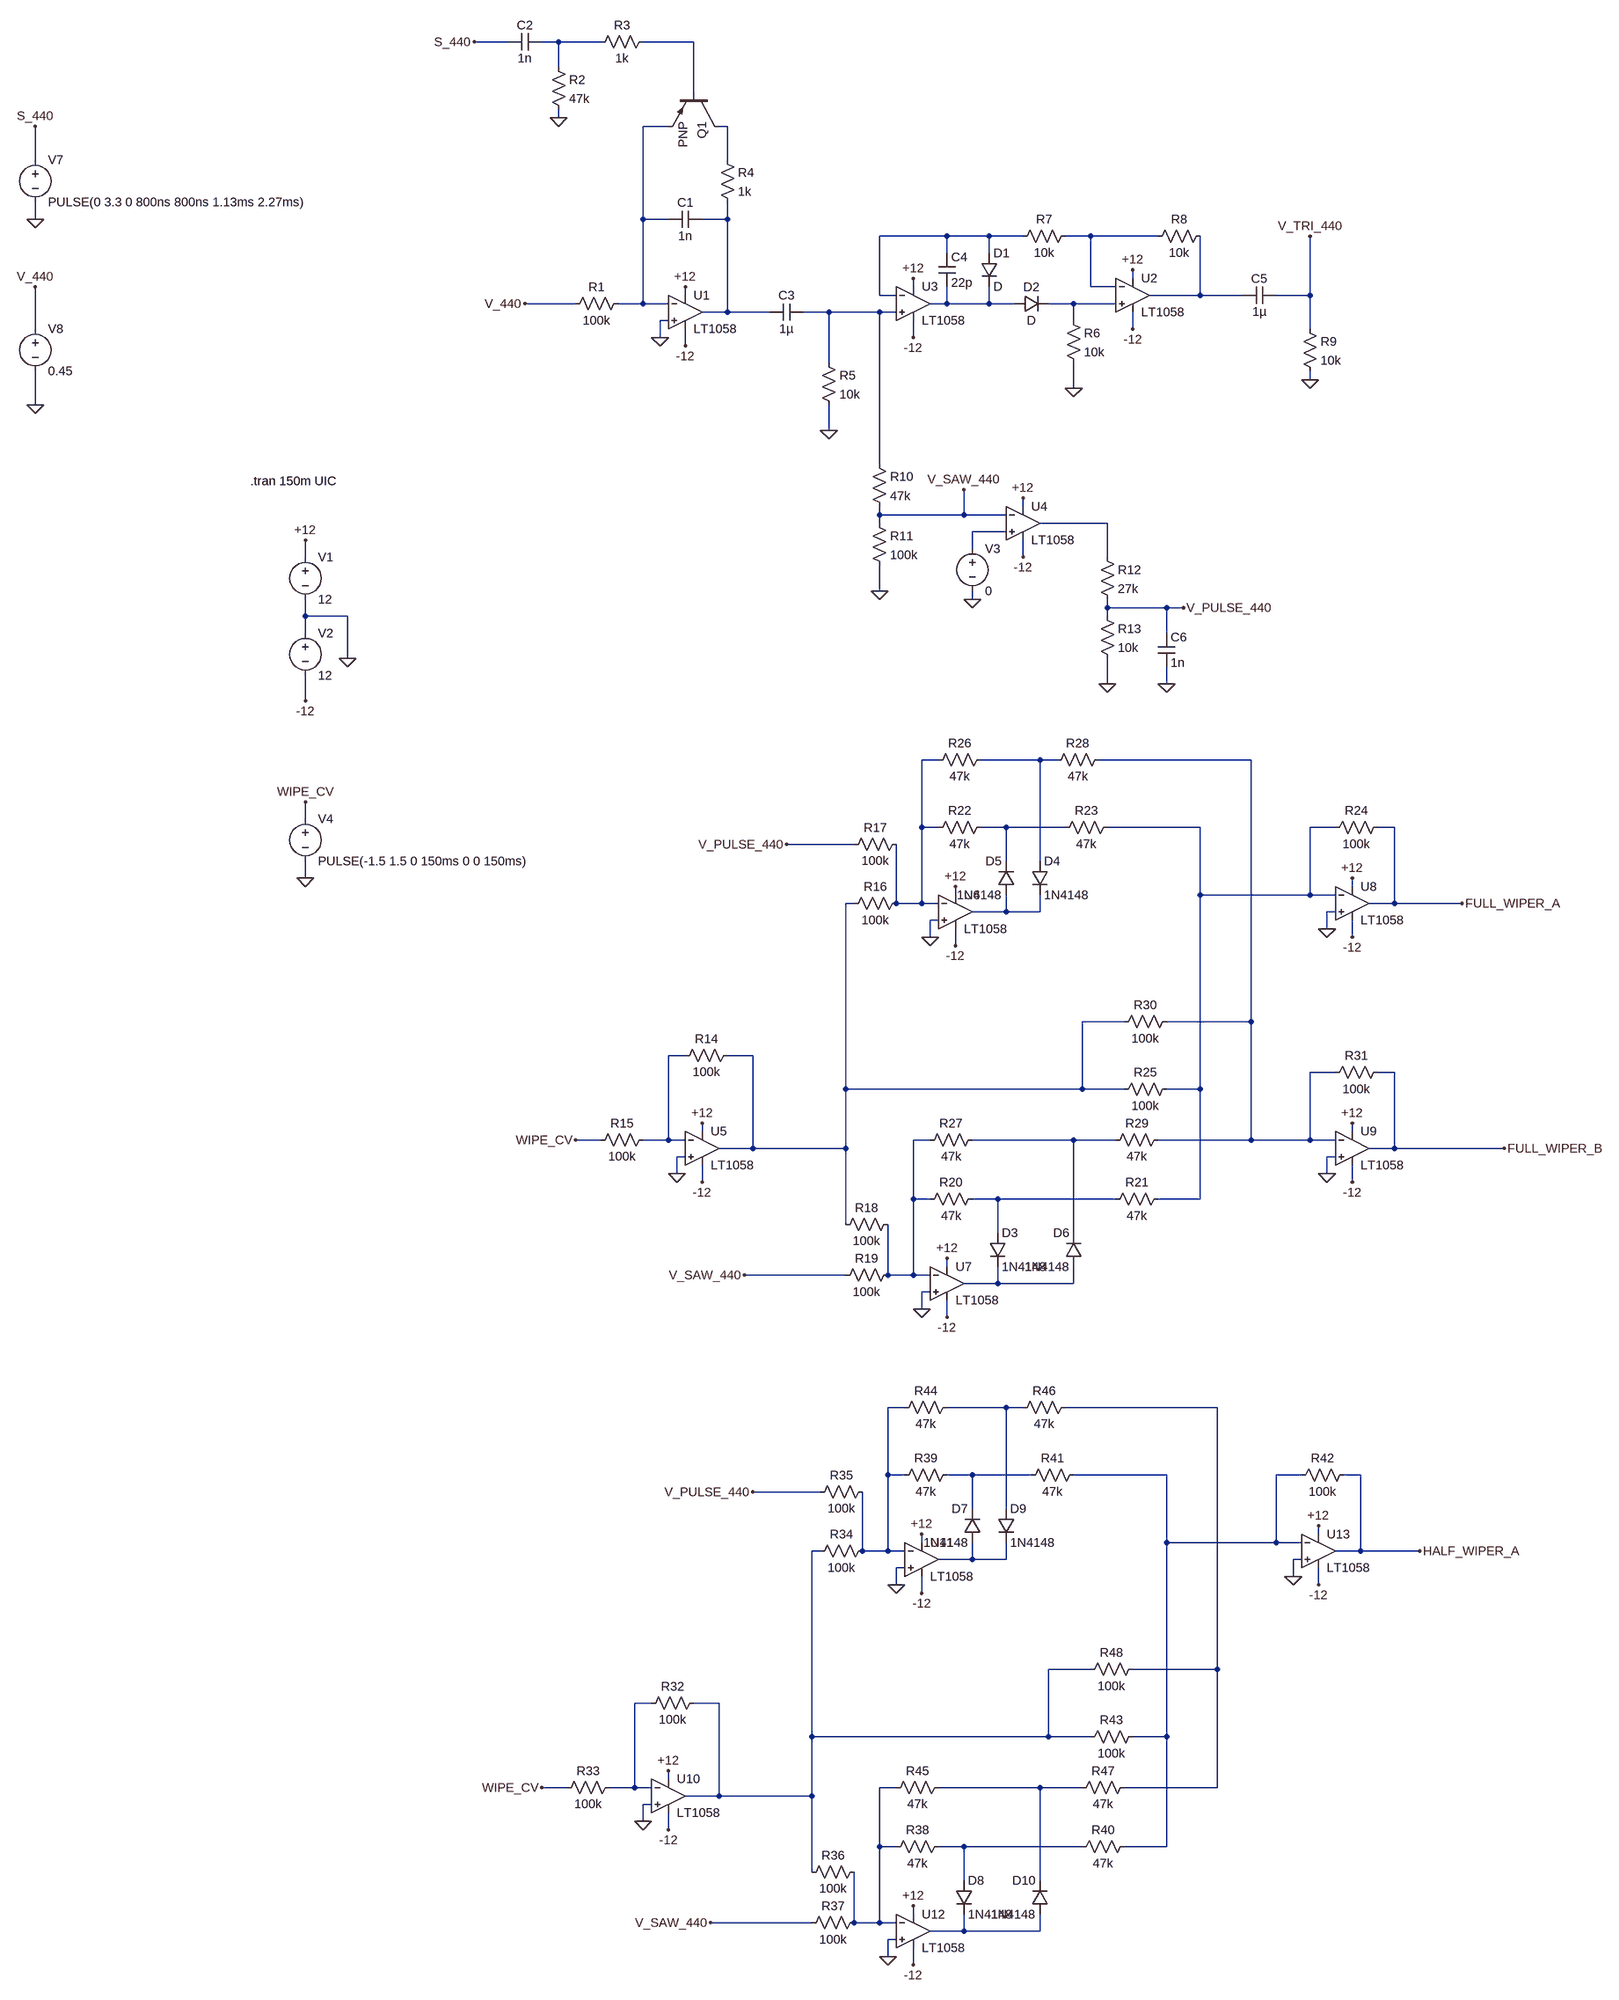
[diagram p0: schematic WiperSim.asc]
WiperSim.asc, the LTspice schematic file:
Version 4
SHEET 1 2512 3292
WIRE 448 -720 384 -720
WIRE 544 -720 512 -720
WIRE 624 -720 544 -720
WIRE 800 -720 704 -720
WIRE 544 -672 544 -720
WIRE 800 -624 800 -720
WIRE 544 -576 544 -592
WIRE 752 -560 704 -560
WIRE 864 -560 848 -560
WIRE -448 -496 -448 -560
WIRE 864 -496 864 -560
WIRE -448 -384 -448 -416
WIRE 704 -384 704 -560
WIRE 752 -384 704 -384
WIRE 864 -384 864 -416
WIRE 864 -384 816 -384
WIRE 1280 -352 1152 -352
WIRE 1360 -352 1280 -352
WIRE 1424 -352 1360 -352
WIRE 1552 -352 1504 -352
WIRE 1680 -352 1552 -352
WIRE 1280 -320 1280 -352
WIRE 1360 -320 1360 -352
WIRE 1632 -272 1632 -288
WIRE 1216 -256 1216 -272
WIRE 1552 -256 1552 -352
WIRE 1600 -256 1552 -256
WIRE 784 -240 784 -256
WIRE 1152 -240 1152 -352
WIRE 1184 -240 1152 -240
WIRE 1760 -240 1760 -352
WIRE 1760 -240 1664 -240
WIRE 1840 -240 1760 -240
WIRE 1968 -240 1968 -352
WIRE 1968 -240 1904 -240
WIRE 576 -224 480 -224
WIRE 704 -224 704 -384
WIRE 704 -224 656 -224
WIRE 752 -224 704 -224
WIRE 1280 -224 1280 -256
WIRE 1280 -224 1248 -224
WIRE 1360 -224 1360 -256
WIRE 1360 -224 1280 -224
WIRE 1408 -224 1360 -224
WIRE 1520 -224 1472 -224
WIRE 1600 -224 1520 -224
WIRE 864 -208 864 -384
WIRE 864 -208 816 -208
WIRE 944 -208 864 -208
WIRE 1056 -208 1008 -208
WIRE 1152 -208 1056 -208
WIRE 1184 -208 1152 -208
WIRE 752 -192 736 -192
WIRE 1520 -192 1520 -224
WIRE -448 -176 -448 -256
WIRE 1632 -176 1632 -208
WIRE 1968 -176 1968 -240
WIRE 736 -160 736 -192
WIRE 1216 -160 1216 -192
WIRE 784 -144 784 -176
WIRE 1056 -112 1056 -208
WIRE 1968 -80 1968 -96
WIRE 1520 -64 1520 -112
WIRE -448 -32 -448 -96
WIRE 1056 16 1056 -32
WIRE 1152 80 1152 -208
WIRE 1424 160 1424 144
WIRE 1152 176 1152 160
WIRE 1312 176 1312 128
WIRE 1312 176 1152 176
WIRE 1392 176 1312 176
WIRE 1152 192 1152 176
WIRE 1584 192 1456 192
WIRE 1392 208 1328 208
WIRE 1328 240 1328 208
WIRE 64 256 64 224
WIRE 1424 256 1424 224
WIRE 1584 256 1584 192
WIRE 1152 320 1152 272
WIRE 1328 336 1328 320
WIRE 1584 352 1584 336
WIRE 1696 352 1584 352
WIRE 1728 352 1696 352
WIRE 64 368 64 336
WIRE 144 368 64 368
WIRE 1584 368 1584 352
WIRE 64 400 64 368
WIRE 1696 400 1696 352
WIRE 144 448 144 368
WIRE 1584 496 1584 448
WIRE 1696 496 1696 464
WIRE 64 528 64 480
WIRE 1264 640 1232 640
WIRE 1456 640 1344 640
WIRE 1488 640 1456 640
WIRE 1856 640 1568 640
WIRE 64 752 64 720
WIRE 1232 768 1232 640
WIRE 1264 768 1232 768
WIRE 1392 768 1344 768
WIRE 1504 768 1392 768
WIRE 1760 768 1584 768
WIRE 2016 768 1968 768
WIRE 2128 768 2096 768
WIRE 1104 800 976 800
WIRE 1392 832 1392 768
WIRE 1456 832 1456 640
WIRE 64 864 64 832
WIRE 2048 880 2048 864
WIRE 1296 896 1296 880
WIRE 1760 896 1760 768
WIRE 1968 896 1968 768
WIRE 1968 896 1760 896
WIRE 2016 896 1968 896
WIRE 1104 912 1088 912
WIRE 1184 912 1184 800
WIRE 1232 912 1232 768
WIRE 1232 912 1184 912
WIRE 1264 912 1232 912
WIRE 2128 912 2128 768
WIRE 2128 912 2080 912
WIRE 2256 912 2128 912
WIRE 1392 928 1392 896
WIRE 1392 928 1328 928
WIRE 1456 928 1456 896
WIRE 1456 928 1392 928
WIRE 2016 928 2000 928
WIRE 1264 944 1248 944
WIRE 2000 960 2000 928
WIRE 1248 976 1248 944
WIRE 2048 976 2048 944
WIRE 1296 992 1296 960
WIRE 1616 1136 1536 1136
WIRE 1856 1136 1856 640
WIRE 1856 1136 1696 1136
WIRE 784 1200 752 1200
WIRE 912 1200 864 1200
WIRE 2016 1232 1968 1232
WIRE 2128 1232 2096 1232
WIRE 1088 1264 1088 912
WIRE 1536 1264 1536 1136
WIRE 1536 1264 1088 1264
WIRE 1616 1264 1536 1264
WIRE 1760 1264 1760 896
WIRE 1760 1264 1696 1264
WIRE 816 1344 816 1328
WIRE 2048 1344 2048 1328
WIRE 624 1360 576 1360
WIRE 752 1360 752 1200
WIRE 752 1360 704 1360
WIRE 784 1360 752 1360
WIRE 1248 1360 1216 1360
WIRE 1520 1360 1328 1360
WIRE 1600 1360 1520 1360
WIRE 1856 1360 1856 1136
WIRE 1856 1360 1680 1360
WIRE 1968 1360 1968 1232
WIRE 1968 1360 1856 1360
WIRE 2016 1360 1968 1360
WIRE 912 1376 912 1200
WIRE 912 1376 848 1376
WIRE 1088 1376 1088 1264
WIRE 1088 1376 912 1376
WIRE 2128 1376 2128 1232
WIRE 2128 1376 2080 1376
WIRE 2336 1376 2128 1376
WIRE 784 1392 768 1392
WIRE 2016 1392 2000 1392
WIRE 768 1424 768 1392
WIRE 2000 1424 2000 1392
WIRE 816 1440 816 1408
WIRE 2048 1440 2048 1408
WIRE 1216 1472 1216 1360
WIRE 1248 1472 1216 1472
WIRE 1376 1472 1328 1472
WIRE 1600 1472 1376 1472
WIRE 1760 1472 1760 1264
WIRE 1760 1472 1680 1472
WIRE 1088 1520 1088 1376
WIRE 1376 1536 1376 1472
WIRE 1520 1536 1520 1360
WIRE 1280 1600 1280 1584
WIRE 1088 1616 896 1616
WIRE 1168 1616 1168 1520
WIRE 1216 1616 1216 1472
WIRE 1216 1616 1168 1616
WIRE 1248 1616 1216 1616
WIRE 1376 1632 1376 1600
WIRE 1376 1632 1312 1632
WIRE 1520 1632 1520 1600
WIRE 1520 1632 1376 1632
WIRE 1248 1648 1232 1648
WIRE 1232 1680 1232 1648
WIRE 1280 1696 1280 1664
WIRE 1200 2160 1168 2160
WIRE 1392 2160 1280 2160
WIRE 1424 2160 1392 2160
WIRE 1792 2160 1504 2160
WIRE 1168 2288 1168 2160
WIRE 1200 2288 1168 2288
WIRE 1328 2288 1280 2288
WIRE 1440 2288 1328 2288
WIRE 1696 2288 1520 2288
WIRE 1952 2288 1904 2288
WIRE 2064 2288 2032 2288
WIRE 1040 2320 912 2320
WIRE 1328 2352 1328 2288
WIRE 1392 2352 1392 2160
WIRE 1984 2400 1984 2384
WIRE 1232 2416 1232 2400
WIRE 1696 2416 1696 2288
WIRE 1904 2416 1904 2288
WIRE 1904 2416 1696 2416
WIRE 1952 2416 1904 2416
WIRE 1040 2432 1024 2432
WIRE 1120 2432 1120 2320
WIRE 1168 2432 1168 2288
WIRE 1168 2432 1120 2432
WIRE 1200 2432 1168 2432
WIRE 2064 2432 2064 2288
WIRE 2064 2432 2016 2432
WIRE 2176 2432 2064 2432
WIRE 1328 2448 1328 2416
WIRE 1328 2448 1264 2448
WIRE 1392 2448 1392 2416
WIRE 1392 2448 1328 2448
WIRE 1952 2448 1936 2448
WIRE 1200 2464 1184 2464
WIRE 1936 2480 1936 2448
WIRE 1184 2496 1184 2464
WIRE 1984 2496 1984 2464
WIRE 1232 2512 1232 2480
WIRE 1552 2656 1472 2656
WIRE 1792 2656 1792 2160
WIRE 1792 2656 1632 2656
WIRE 720 2720 688 2720
WIRE 848 2720 800 2720
WIRE 1024 2784 1024 2432
WIRE 1472 2784 1472 2656
WIRE 1472 2784 1024 2784
WIRE 1552 2784 1472 2784
WIRE 1696 2784 1696 2416
WIRE 1696 2784 1632 2784
WIRE 752 2864 752 2848
WIRE 560 2880 512 2880
WIRE 688 2880 688 2720
WIRE 688 2880 640 2880
WIRE 720 2880 688 2880
WIRE 1184 2880 1152 2880
WIRE 1456 2880 1264 2880
WIRE 1536 2880 1456 2880
WIRE 1792 2880 1792 2656
WIRE 1792 2880 1616 2880
WIRE 848 2896 848 2720
WIRE 848 2896 784 2896
WIRE 1024 2896 1024 2784
WIRE 1024 2896 848 2896
WIRE 720 2912 704 2912
WIRE 704 2944 704 2912
WIRE 752 2960 752 2928
WIRE 1152 2992 1152 2880
WIRE 1184 2992 1152 2992
WIRE 1312 2992 1264 2992
WIRE 1536 2992 1312 2992
WIRE 1696 2992 1696 2784
WIRE 1696 2992 1616 2992
WIRE 1024 3040 1024 2896
WIRE 1312 3056 1312 2992
WIRE 1456 3056 1456 2880
WIRE 1216 3120 1216 3104
WIRE 1024 3136 832 3136
WIRE 1104 3136 1104 3040
WIRE 1152 3136 1152 2992
WIRE 1152 3136 1104 3136
WIRE 1184 3136 1152 3136
WIRE 1312 3152 1312 3120
WIRE 1312 3152 1248 3152
WIRE 1456 3152 1456 3120
WIRE 1456 3152 1312 3152
WIRE 1184 3168 1168 3168
WIRE 1168 3200 1168 3168
WIRE 1216 3216 1216 3184
FLAG 64 224 +12
FLAG 64 528 -12
FLAG 144 448 0
FLAG 784 -256 +12
FLAG 784 -144 -12
FLAG 384 -720 S_440
FLAG 736 -160 0
FLAG 544 -576 0
FLAG 480 -224 V_440
FLAG 1216 -272 +12
FLAG 1216 -160 -12
FLAG 1056 16 0
FLAG 1632 -288 +12
FLAG 1632 -176 -12
FLAG 1520 -64 0
FLAG -448 -384 0
FLAG -448 -560 S_440
FLAG -448 -256 V_440
FLAG -448 -32 0
FLAG 1968 -80 0
FLAG 1968 -352 V_TRI_440
FLAG 1152 320 0
FLAG 1312 128 V_SAW_440
FLAG 1424 144 +12
FLAG 1424 256 -12
FLAG 1328 336 0
FLAG 1584 496 0
FLAG 1728 352 V_PULSE_440
FLAG 64 720 WIPE_CV
FLAG 64 864 0
FLAG 816 1328 +12
FLAG 816 1440 -12
FLAG 768 1424 0
FLAG 576 1360 WIPE_CV
FLAG 1296 880 +12
FLAG 1296 992 -12
FLAG 1248 976 0
FLAG 1280 1584 +12
FLAG 1280 1696 -12
FLAG 1232 1680 0
FLAG 976 800 V_PULSE_440
FLAG 896 1616 V_SAW_440
FLAG 2048 864 +12
FLAG 2048 976 -12
FLAG 2000 960 0
FLAG 1696 496 0
FLAG 2048 1328 +12
FLAG 2048 1440 -12
FLAG 2000 1424 0
FLAG 752 2848 +12
FLAG 752 2960 -12
FLAG 704 2944 0
FLAG 512 2880 WIPE_CV
FLAG 1232 2400 +12
FLAG 1232 2512 -12
FLAG 1184 2496 0
FLAG 1216 3104 +12
FLAG 1216 3216 -12
FLAG 1168 3200 0
FLAG 912 2320 V_PULSE_440
FLAG 832 3136 V_SAW_440
FLAG 1984 2384 +12
FLAG 1984 2496 -12
FLAG 1936 2480 0
FLAG 2256 912 FULL_WIPER_A
FLAG 2336 1376 FULL_WIPER_B
FLAG 2176 2432 HALF_WIPER_A
SYMBOL voltage 64 240 R0
SYMATTR InstName V1
SYMATTR Value 12
SYMBOL voltage 64 384 R0
SYMATTR InstName V2
SYMATTR Value 12
SYMBOL OpAmps/LT1058 784 -272 R0
SYMATTR InstName U1
SYMBOL cap 816 -400 R90
WINDOW 0 0 32 VBottom 2
WINDOW 3 32 32 VTop 2
SYMATTR InstName C1
SYMATTR Value 1n
SYMBOL res 672 -240 R90
WINDOW 0 0 56 VBottom 2
WINDOW 3 32 56 VTop 2
SYMATTR InstName R1
SYMATTR Value 100k
SYMBOL cap 512 -736 R90
WINDOW 0 0 32 VBottom 2
WINDOW 3 32 32 VTop 2
SYMATTR InstName C2
SYMATTR Value 1n
SYMBOL res 528 -688 R0
SYMATTR InstName R2
SYMATTR Value 47k
SYMBOL res 848 -512 R0
SYMATTR InstName R4
SYMATTR Value 1k
SYMBOL res 720 -736 R90
WINDOW 0 0 56 VBottom 2
WINDOW 3 32 56 VTop 2
SYMATTR InstName R3
SYMATTR Value 1k
SYMBOL pnp 848 -624 R90
SYMATTR InstName Q1
SYMBOL cap 1008 -224 R90
WINDOW 0 0 32 VBottom 2
WINDOW 3 32 32 VTop 2
SYMATTR InstName C3
SYMATTR Value 1µ
SYMBOL OpAmps/LT1058 1216 -288 R0
SYMATTR InstName U3
SYMBOL res 1040 -128 R0
SYMATTR InstName R5
SYMATTR Value 10k
SYMBOL diode 1344 -320 R0
SYMATTR InstName D1
SYMBOL diode 1408 -208 R270
WINDOW 0 32 32 VTop 2
WINDOW 3 0 32 VBottom 2
SYMATTR InstName D2
SYMBOL cap 1264 -320 R0
SYMATTR InstName C4
SYMATTR Value 22p
SYMBOL OpAmps/LT1058 1632 -304 R0
SYMATTR InstName U2
SYMBOL res 1504 -208 R0
SYMATTR InstName R6
SYMATTR Value 10k
SYMBOL res 1520 -368 R90
WINDOW 0 0 56 VBottom 2
WINDOW 3 32 56 VTop 2
SYMATTR InstName R7
SYMATTR Value 10k
SYMBOL res 1776 -368 R90
WINDOW 0 0 56 VBottom 2
WINDOW 3 32 56 VTop 2
SYMATTR InstName R8
SYMATTR Value 10k
SYMBOL cap 1904 -256 R90
WINDOW 0 0 32 VBottom 2
WINDOW 3 32 32 VTop 2
SYMATTR InstName C5
SYMATTR Value 1µ
SYMBOL voltage -448 -512 R0
SYMATTR InstName V7
SYMATTR Value PULSE(0 3.3 0 800ns 800ns 1.13ms 2.27ms)
SYMBOL voltage -448 -192 R0
SYMATTR InstName V8
SYMATTR Value 0.45
SYMBOL res 1952 -192 R0
SYMATTR InstName R9
SYMATTR Value 10k
SYMBOL res 1136 64 R0
SYMATTR InstName R10
SYMATTR Value 47k
SYMBOL res 1136 176 R0
SYMATTR InstName R11
SYMATTR Value 100k
SYMBOL OpAmps/LT1058 1424 128 R0
SYMATTR InstName U4
SYMBOL voltage 1328 224 R0
SYMATTR InstName V3
SYMATTR Value 0
SYMBOL res 1568 240 R0
SYMATTR InstName R12
SYMATTR Value 27k
SYMBOL res 1568 352 R0
SYMATTR InstName R13
SYMATTR Value 10k
SYMBOL voltage 64 736 R0
SYMATTR InstName V4
SYMATTR Value PULSE(-1.5 1.5 0 150ms 0 0 150ms)
SYMBOL OpAmps/LT1058 816 1312 R0
SYMATTR InstName U5
SYMBOL res 880 1184 R90
WINDOW 0 0 56 VBottom 2
WINDOW 3 32 56 VTop 2
SYMATTR InstName R14
SYMATTR Value 100k
SYMBOL res 720 1344 R90
WINDOW 0 0 56 VBottom 2
WINDOW 3 32 56 VTop 2
SYMATTR InstName R15
SYMATTR Value 100k
SYMBOL OpAmps/LT1058 1296 864 R0
SYMATTR InstName U6
SYMBOL OpAmps/LT1058 1280 1568 R0
SYMATTR InstName U7
SYMBOL res 1200 896 R90
WINDOW 0 0 56 VBottom 2
WINDOW 3 32 56 VTop 2
SYMATTR InstName R16
SYMATTR Value 100k
SYMBOL res 1200 784 R90
WINDOW 0 0 56 VBottom 2
WINDOW 3 32 56 VTop 2
SYMATTR InstName R17
SYMATTR Value 100k
SYMBOL res 1184 1504 R90
WINDOW 0 0 56 VBottom 2
WINDOW 3 32 56 VTop 2
SYMATTR InstName R18
SYMATTR Value 100k
SYMBOL res 1184 1600 R90
WINDOW 0 0 56 VBottom 2
WINDOW 3 32 56 VTop 2
SYMATTR InstName R19
SYMATTR Value 100k
SYMBOL res 1344 1456 R90
WINDOW 0 0 56 VBottom 2
WINDOW 3 32 56 VTop 2
SYMATTR InstName R20
SYMATTR Value 47k
SYMBOL res 1360 752 R90
WINDOW 0 0 56 VBottom 2
WINDOW 3 32 56 VTop 2
SYMATTR InstName R22
SYMATTR Value 47k
SYMBOL diode 1408 896 R180
WINDOW 0 24 64 Left 2
WINDOW 3 24 0 Left 2
SYMATTR InstName D5
SYMATTR Value 1N4148
SYMBOL diode 1360 1536 R0
SYMATTR InstName D3
SYMATTR Value 1N4148
SYMBOL res 1696 1456 R90
WINDOW 0 0 56 VBottom 2
WINDOW 3 32 56 VTop 2
SYMATTR InstName R21
SYMATTR Value 47k
SYMBOL res 1600 752 R90
WINDOW 0 0 56 VBottom 2
WINDOW 3 32 56 VTop 2
SYMATTR InstName R23
SYMATTR Value 47k
SYMBOL OpAmps/LT1058 2048 848 R0
SYMATTR InstName U8
SYMBOL res 2112 752 R90
WINDOW 0 0 56 VBottom 2
WINDOW 3 32 56 VTop 2
SYMATTR InstName R24
SYMATTR Value 100k
SYMBOL cap 1680 400 R0
SYMATTR InstName C6
SYMATTR Value 1n
SYMBOL res 1712 1248 R90
WINDOW 0 0 56 VBottom 2
WINDOW 3 32 56 VTop 2
SYMATTR InstName R25
SYMATTR Value 100k
SYMBOL diode 1440 832 R0
SYMATTR InstName D4
SYMATTR Value 1N4148
SYMBOL res 1360 624 R90
WINDOW 0 0 56 VBottom 2
WINDOW 3 32 56 VTop 2
SYMATTR InstName R26
SYMATTR Value 47k
SYMBOL res 1344 1344 R90
WINDOW 0 0 56 VBottom 2
WINDOW 3 32 56 VTop 2
SYMATTR InstName R27
SYMATTR Value 47k
SYMBOL diode 1536 1600 R180
WINDOW 0 24 64 Left 2
WINDOW 3 24 0 Left 2
SYMATTR InstName D6
SYMATTR Value 1N4148
SYMBOL res 1584 624 R90
WINDOW 0 0 56 VBottom 2
WINDOW 3 32 56 VTop 2
SYMATTR InstName R28
SYMATTR Value 47k
SYMBOL res 1696 1344 R90
WINDOW 0 0 56 VBottom 2
WINDOW 3 32 56 VTop 2
SYMATTR InstName R29
SYMATTR Value 47k
SYMBOL res 1712 1120 R90
WINDOW 0 0 56 VBottom 2
WINDOW 3 32 56 VTop 2
SYMATTR InstName R30
SYMATTR Value 100k
SYMBOL OpAmps/LT1058 2048 1312 R0
SYMATTR InstName U9
SYMBOL res 2112 1216 R90
WINDOW 0 0 56 VBottom 2
WINDOW 3 32 56 VTop 2
SYMATTR InstName R31
SYMATTR Value 100k
SYMBOL OpAmps/LT1058 752 2832 R0
SYMATTR InstName U10
SYMBOL res 816 2704 R90
WINDOW 0 0 56 VBottom 2
WINDOW 3 32 56 VTop 2
SYMATTR InstName R32
SYMATTR Value 100k
SYMBOL res 656 2864 R90
WINDOW 0 0 56 VBottom 2
WINDOW 3 32 56 VTop 2
SYMATTR InstName R33
SYMATTR Value 100k
SYMBOL OpAmps/LT1058 1232 2384 R0
SYMATTR InstName U11
SYMBOL OpAmps/LT1058 1216 3088 R0
SYMATTR InstName U12
SYMBOL res 1136 2416 R90
WINDOW 0 0 56 VBottom 2
WINDOW 3 32 56 VTop 2
SYMATTR InstName R34
SYMATTR Value 100k
SYMBOL res 1136 2304 R90
WINDOW 0 0 56 VBottom 2
WINDOW 3 32 56 VTop 2
SYMATTR InstName R35
SYMATTR Value 100k
SYMBOL res 1120 3024 R90
WINDOW 0 0 56 VBottom 2
WINDOW 3 32 56 VTop 2
SYMATTR InstName R36
SYMATTR Value 100k
SYMBOL res 1120 3120 R90
WINDOW 0 0 56 VBottom 2
WINDOW 3 32 56 VTop 2
SYMATTR InstName R37
SYMATTR Value 100k
SYMBOL res 1280 2976 R90
WINDOW 0 0 56 VBottom 2
WINDOW 3 32 56 VTop 2
SYMATTR InstName R38
SYMATTR Value 47k
SYMBOL res 1296 2272 R90
WINDOW 0 0 56 VBottom 2
WINDOW 3 32 56 VTop 2
SYMATTR InstName R39
SYMATTR Value 47k
SYMBOL diode 1344 2416 R180
WINDOW 0 24 64 Left 2
WINDOW 3 24 0 Left 2
SYMATTR InstName D7
SYMATTR Value 1N4148
SYMBOL diode 1296 3056 R0
SYMATTR InstName D8
SYMATTR Value 1N4148
SYMBOL res 1632 2976 R90
WINDOW 0 0 56 VBottom 2
WINDOW 3 32 56 VTop 2
SYMATTR InstName R40
SYMATTR Value 47k
SYMBOL res 1536 2272 R90
WINDOW 0 0 56 VBottom 2
WINDOW 3 32 56 VTop 2
SYMATTR InstName R41
SYMATTR Value 47k
SYMBOL OpAmps/LT1058 1984 2368 R0
SYMATTR InstName U13
SYMBOL res 2048 2272 R90
WINDOW 0 0 56 VBottom 2
WINDOW 3 32 56 VTop 2
SYMATTR InstName R42
SYMATTR Value 100k
SYMBOL res 1648 2768 R90
WINDOW 0 0 56 VBottom 2
WINDOW 3 32 56 VTop 2
SYMATTR InstName R43
SYMATTR Value 100k
SYMBOL diode 1376 2352 R0
SYMATTR InstName D9
SYMATTR Value 1N4148
SYMBOL res 1296 2144 R90
WINDOW 0 0 56 VBottom 2
WINDOW 3 32 56 VTop 2
SYMATTR InstName R44
SYMATTR Value 47k
SYMBOL res 1280 2864 R90
WINDOW 0 0 56 VBottom 2
WINDOW 3 32 56 VTop 2
SYMATTR InstName R45
SYMATTR Value 47k
SYMBOL diode 1472 3120 R180
WINDOW 0 24 64 Left 2
WINDOW 3 24 0 Left 2
SYMATTR InstName D10
SYMATTR Value 1N4148
SYMBOL res 1520 2144 R90
WINDOW 0 0 56 VBottom 2
WINDOW 3 32 56 VTop 2
SYMATTR InstName R46
SYMATTR Value 47k
SYMBOL res 1632 2864 R90
WINDOW 0 0 56 VBottom 2
WINDOW 3 32 56 VTop 2
SYMATTR InstName R47
SYMATTR Value 47k
SYMBOL res 1648 2640 R90
WINDOW 0 0 56 VBottom 2
WINDOW 3 32 56 VTop 2
SYMATTR InstName R48
SYMATTR Value 100k
TEXT -40 112 Left 2 !.tran 150m UIC

The netlist it stands for:
* WiperSim.asc
V1 +12 0 12
V2 0 -12 12
XU1 0 N003 +12 -12 N005 LT1057  ; LT1058, pins In+ In- V+ V- OUT
C1 N005 N003 1n
R1 N003 V_440 100k
C2 N001 S_440 1n
R2 N001 0 47k
R4 N004 N005 1k
R3 N002 N001 1k
Q1 N004 N002 N003 0 PNP
C3 N011 N005 1µ
XU3 N011 N006 +12 -12 N009 LT1057  ; LT1058, pins In+ In- V+ V- OUT
R5 N011 0 10k
D1 N006 N009 D
D2 N009 N010 D
C4 N006 N009 22p
XU2 N010 N007 +12 -12 N008 LT1057  ; LT1058, pins In+ In- V+ V- OUT
R6 N010 0 10k
R7 N007 N006 10k
R8 N008 N007 10k
C5 V_TRI_440 N008 1µ
V7 S_440 0 PULSE(0 3.3 0 800ns 800ns 1.13ms 2.27ms)
V8 V_440 0 0.45
R9 V_TRI_440 0 10k
R10 N011 V_SAW_440 47k
R11 V_SAW_440 0 100k
XU4 N013 V_SAW_440 +12 -12 N012 LT1057  ; LT1058, pins In+ In- V+ V- OUT
V3 N013 0 0
R12 N012 V_PULSE_440 27k
R13 V_PULSE_440 0 10k
V4 WIPE_CV 0 PULSE(-1.5 1.5 0 150ms 0 0 150ms)
XU5 0 N021 +12 -12 N019 LT1057  ; LT1058, pins In+ In- V+ V- OUT
R14 N019 N021 100k
R15 N021 WIPE_CV 100k
XU6 0 N014 +12 -12 N020 LT1057  ; LT1058, pins In+ In- V+ V- OUT
XU7 0 N022 +12 -12 N025 LT1057  ; LT1058, pins In+ In- V+ V- OUT
R16 N014 N019 100k
R17 N014 V_PULSE_440 100k
R18 N022 N019 100k
R19 N022 V_SAW_440 100k
R20 N024 N022 47k
R22 N017 N014 47k
D5 N020 N017 1N4148
D3 N024 N025 1N4148
R21 N018 N024 47k
R23 N018 N017 47k
XU8 0 N018 +12 -12 FULL_WIPER_A LT1057  ; LT1058, pins In+ In- V+ V- OUT
R24 FULL_WIPER_A N018 100k
C6 V_PULSE_440 0 1n
R25 N018 N019 100k
D4 N015 N020 1N4148
R26 N015 N014 47k
R27 N023 N022 47k
D6 N025 N023 1N4148
R28 N016 N015 47k
R29 N016 N023 47k
R30 N016 N019 100k
XU9 0 N016 +12 -12 FULL_WIPER_B LT1057  ; LT1058, pins In+ In- V+ V- OUT
R31 FULL_WIPER_B N016 100k
XU10 0 N033 +12 -12 N031 LT1057  ; LT1058, pins In+ In- V+ V- OUT
R32 N031 N033 100k
R33 N033 WIPE_CV 100k
XU11 0 N026 +12 -12 N032 LT1057  ; LT1058, pins In+ In- V+ V- OUT
XU12 0 N034 +12 -12 N037 LT1057  ; LT1058, pins In+ In- V+ V- OUT
R34 N026 N031 100k
R35 N026 V_PULSE_440 100k
R36 N034 N031 100k
R37 N034 V_SAW_440 100k
R38 N036 N034 47k
R39 N029 N026 47k
D7 N032 N029 1N4148
D8 N036 N037 1N4148
R40 N030 N036 47k
R41 N030 N029 47k
XU13 0 N030 +12 -12 HALF_WIPER_A LT1057  ; LT1058, pins In+ In- V+ V- OUT
R42 HALF_WIPER_A N030 100k
R43 N030 N031 100k
D9 N027 N032 1N4148
R44 N027 N026 47k
R45 N035 N034 47k
D10 N037 N035 1N4148
R46 N028 N027 47k
R47 N028 N035 47k
R48 N028 N031 100k
.model D D
.lib standard.dio
.model NPN NPN
.model PNP PNP
.lib standard.bjt
.tran 150m UIC
.lib LTC.lib
.backanno
.end